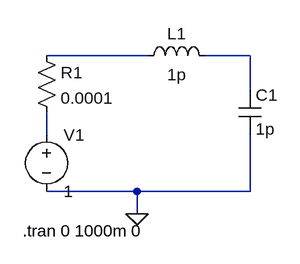
[diagram p0: schematic rlc.asc]
rlc.asc, the LTspice schematic file:
Version 4
SHEET 1 880 680
WIRE 208 32 64 32
WIRE 352 32 288 32
WIRE 352 80 352 32
WIRE 64 144 64 112
WIRE 192 224 64 224
WIRE 352 224 352 144
WIRE 352 224 192 224
WIRE 192 256 192 224
FLAG 192 256 0
SYMBOL voltage 64 128 R0
SYMATTR InstName V1
SYMATTR Value 1
SYMBOL res 48 16 R0
SYMATTR InstName R1
SYMATTR Value 0.0001
SYMBOL ind 192 48 R270
WINDOW 0 32 56 VTop 2
WINDOW 3 5 56 VBottom 2
SYMATTR InstName L1
SYMATTR Value 1p
SYMBOL cap 336 80 R0
SYMATTR InstName C1
SYMATTR Value 1p
TEXT 30 280 Left 2 !.tran 0 1000m 0

The netlist it stands for:
* rlc.asc
V1 N003 0 1
R1 N001 N003 0.0001
L1 N001 N002 1p
C1 N002 0 1p
.tran 0 1000m 0
.backanno
.end